# Altium schematic sheet protocol-bridge.SchDoc
size A3
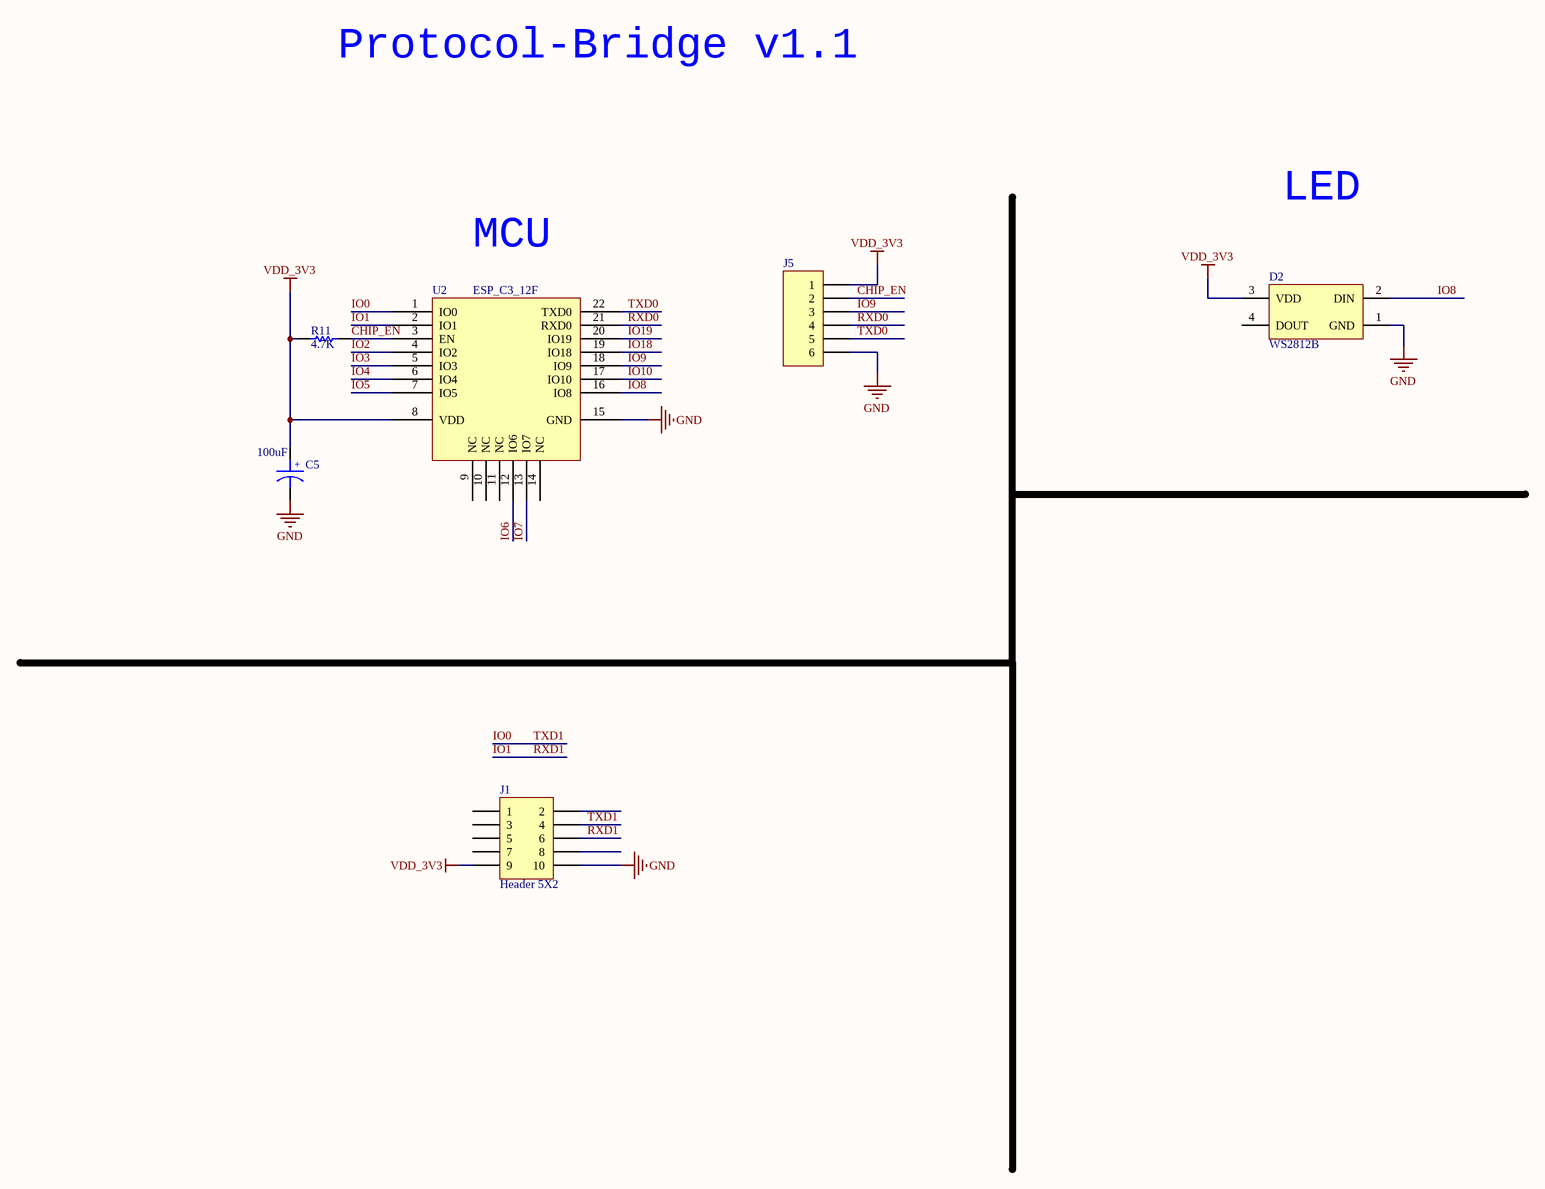
[diagram p0: protocol-bridge.SchDoc]

## Parts
C5  100uF  [SMT_C_Tantalum_B]
D2  WS2812B  [LED 3528-4Pin]
J1  Header 5X2  [HEAD_1.27_5x2]
J5  (no value)  [HEADER_1.27_SMT_6x1]
R11  4.7K  [0603_R]
U2  ESP_C3_12F  [ESP-C3-12F]

## Nets
GND: C5.2 D2.1(GND) J1.10 J5.6 U2.15(GND)
VDD_3V3: C5.1 D2.3(VDD) J1.9 J5.1 R11.2 U2.8(VDD)
CHIP_EN: J5.2 R11.1 U2.3(EN)
IO0: J1.4 U2.1(IO0)  [also labelled TXD1]
IO1: J1.6 U2.2(IO1)  [also labelled RXD1]
IO2: U2.4(IO2)
IO3: U2.5(IO3)
IO4: U2.6(IO4)
IO5: U2.7(IO5)
IO6: U2.12(IO6)
IO7: U2.13(IO7)
IO8: D2.2(DIN) U2.16(IO8)
IO9: J5.3 U2.18(IO9)
IO10: U2.17(IO10)
IO18: U2.19(IO18)
IO19: U2.20(IO19)
RXD0: J5.4 U2.21(RXD0)
TXD0: J5.5 U2.22(TXD0)

Not connected (* = marked no-connect by the designer): D2 4(DOUT); J1 1 2 3 5 7 8; U2 9(NC) 10(NC) 11(NC) 14(NC)

## Notes on the sheet
- Protocol-Bridge v1.1
- LED
- MCU
- (in symbol SMT_C_Tantalum_B) +

## Library data of the parts
C5 = SMT_C_Tantalum_B: Capacitor, SM Tantalum; Body 3.5 x 2.8 mm (LxW typ)
J1 = Header 5X2: Header, 5-Pin, Dual row; Manufacturer: Generic Components; Class: Connector
J5 = Header_6: Header, 4-Pin; LatestRevisionDate: 17-Jul-2002; LatestRevisionNote: Re-released for DXP Platform.; Publisher: Altium Limited
R11 = R0603: Resistor; Published: 8-Jun-2000; LatestRevisionDate: 17-Jul-2002; LatestRevisionNote: Re-released for DXP Platform.; PackageReference: AXIAL-0.3; Publisher: Altium Limited; PackageDescription: Axial Device, Thru-Hole; 2 Leads; 0.3 in Pin Spacing; Value: 4.7K
U2 = ESP32_C3_12F: ESP-12 Wi-Fi Module by AI-Thinker; IC: ESP8266-EX; Vendor: Ai-thinker